# EAGLE design auxboxshield1.7test (EAGLE 6.5.0)
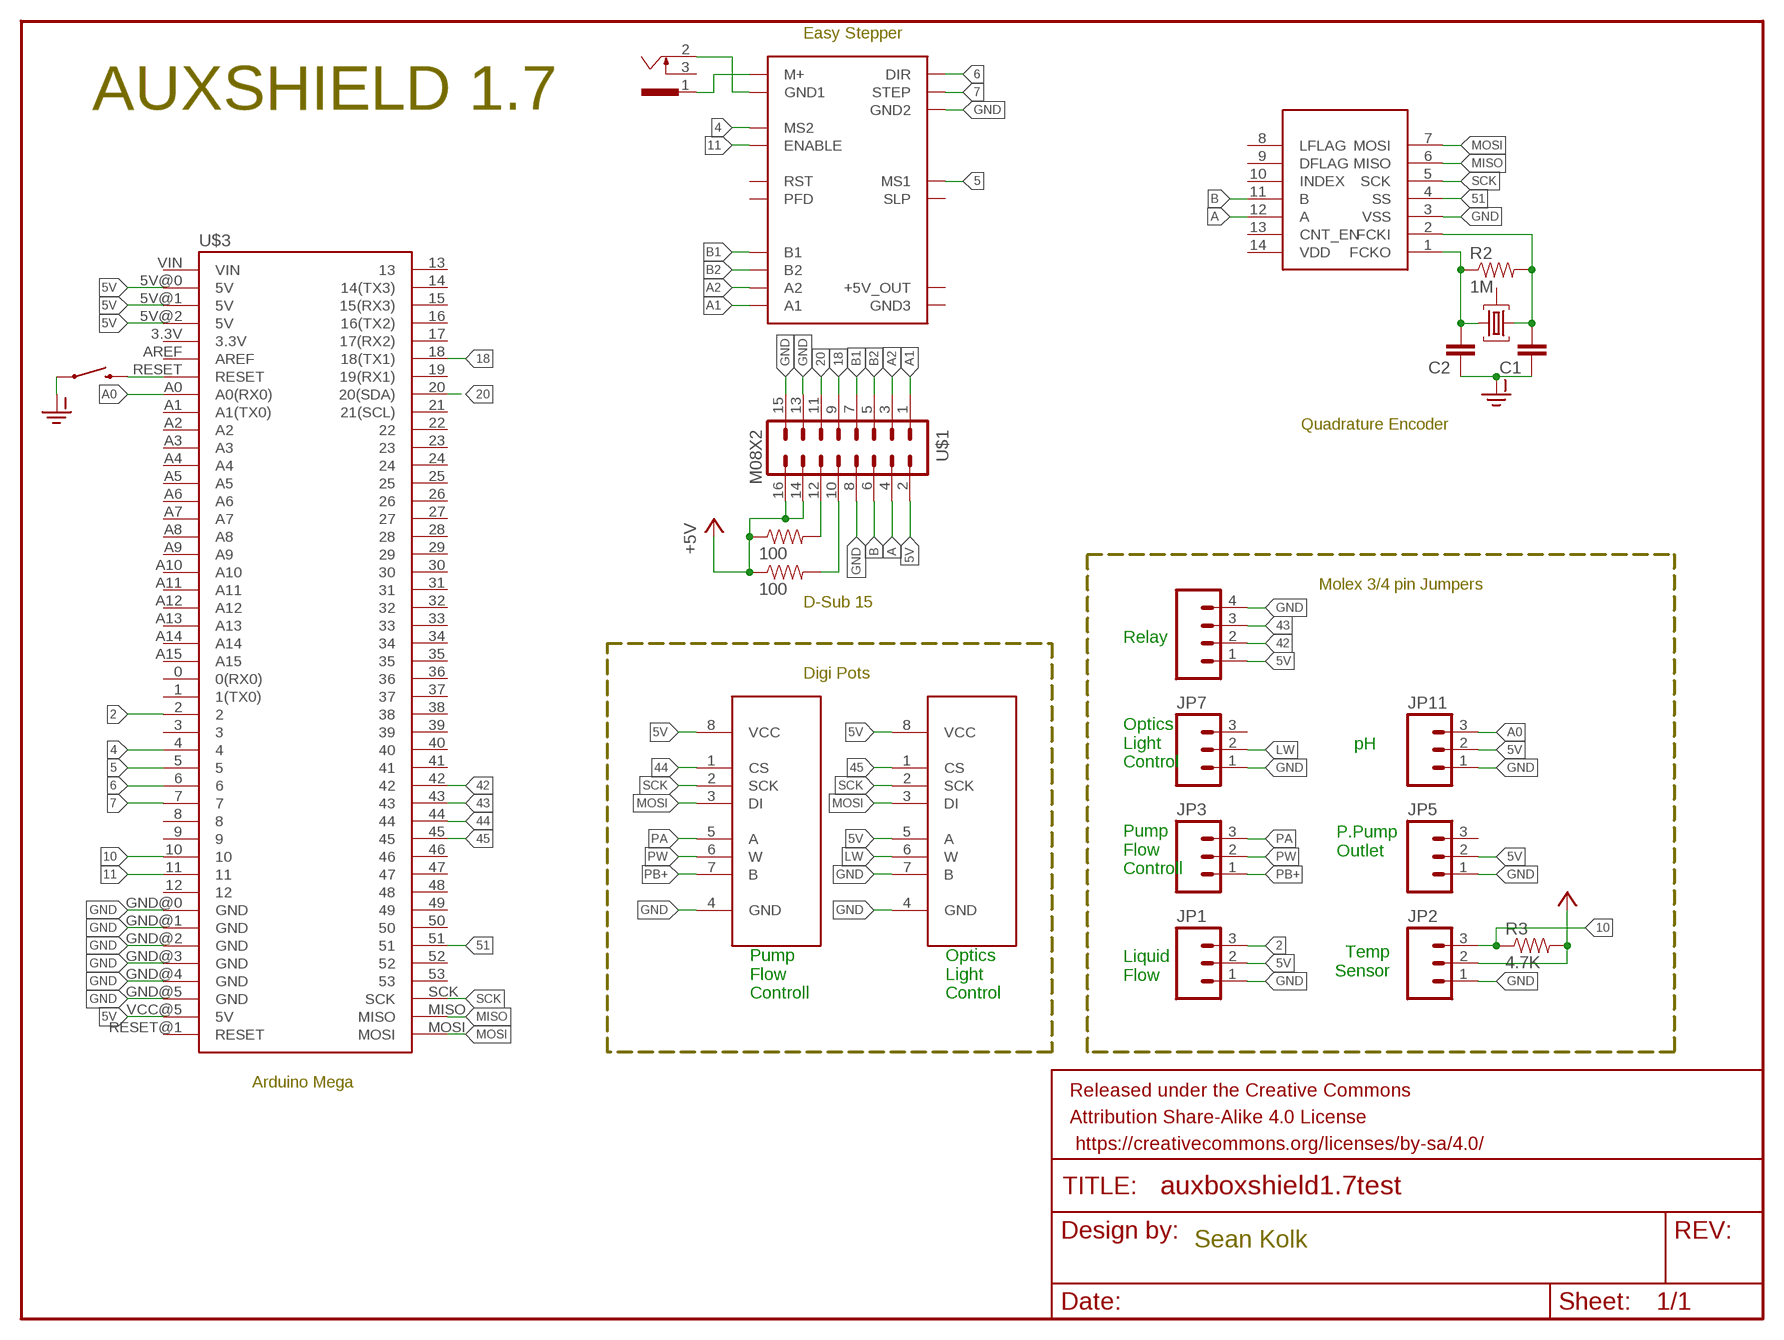
[diagram p0: schematic, sheet 1]

## Parts
C1  0.1UF-50V-20%(PTH)KIT-EZ  [CAP-PTH-SMALL-KIT]
C2  0.1UF-50V-20%(PTH)KIT-EZ  [CAP-PTH-SMALL-KIT]
EASYDRIVER_V44  EASYDRIVER_V44  [EASYDRIVER_V44]
FRAME1  FRAME-LETTER  [CREATIVE_COMMONS]
JP1  M03POLAR  [MOLEX-1X3]
JP2  M03POLAR  [MOLEX-1X3]
JP3  M03POLAR  [MOLEX-1X3]
JP5  M03POLAR  [MOLEX-1X3]
JP7  M03POLAR  [MOLEX-1X3]
JP11  M03POLAR  [MOLEX-1X3]
PUMPDIGIPOT  MCP41XXXDIL  [DIL-08]
QF1  21M30AUM5  [UM5]
R1  100  10OHM-1/4W-5%(PTH)  [AXIAL-0.3]
R2  1M  10OHM-1/4W-5%(PTH)  [AXIAL-0.3]
R3  4.7K  10OHM-1/4W-5%(PTH)  [AXIAL-0.3]
R4  100  10OHM-1/4W-5%(PTH)  [AXIAL-0.3]
RELAY  M04POLAR  [MOLEX-1X4]
S1  SWITCH-MOMENTARY-2PTH_EZ  [TACTILE-PTH-EZ]
U1  MCP41XXXDIL  [DIL-08]
U$1  M08X2  [2X8]
U$2  LS7366R  [SO014]
U$3  ARDUINO-MEGA-V2  [ARDUINO_MEGA-PRO-5V]
X1  SCD-014A  [SCD-014-A]

## Nets
2: JP1.3 U$3.2
4: EASYDRIVER_V44.MS2 U$3.4
5: EASYDRIVER_V44.MS1 U$3.5
5V: JP1.2 JP5.2 JP11.2 PUMPDIGIPOT.8(VCC) RELAY.1 U1.5(A) U1.8(VCC) U$1.2 U$3.5V@0(5V) U$3.5V@1(5V) U$3.5V@2(5V) U$3.VCC@5(5V)
6: EASYDRIVER_V44.DIR U$3.6
7: EASYDRIVER_V44.STEP U$3.7
10: JP2.3 R3.P$1 U$3.10
11: EASYDRIVER_V44.ENABLE U$3.11
18: U$1.9 U$3.18(18(TX1))
20: U$1.11 U$3.20(20(SDA))
42: RELAY.2 U$3.42
43: RELAY.3 U$3.43
44: PUMPDIGIPOT.1(CS) U$3.44
45: U1.1(CS) U$3.45
51: U$2.4(SS) U$3.51
+5V: JP2.2 R1.P$1 R3.P$2 R4.P$1 U$1.14 U$1.16
A: U$1.4 U$2.12(A)
A0: JP11.3 U$3.A0(A0(RX0))
A1: EASYDRIVER_V44.A1 U$1.1
A2: EASYDRIVER_V44.A2 U$1.3
B: U$1.6 U$2.11(B)
B1: EASYDRIVER_V44.B1 U$1.7
B2: EASYDRIVER_V44.B2 U$1.5
GND: EASYDRIVER_V44.GND2 JP1.1 JP2.1 JP5.1 JP7.1 JP11.1 PUMPDIGIPOT.4(GND) RELAY.4 U1.4(GND) U1.7(B) U$1.8 U$1.13 U$1.15 U$2.3(VSS) U$3.GND@0(GND) U$3.GND@1(GND) U$3.GND@2(GND) U$3.GND@3(GND) U$3.GND@4(GND) U$3.GND@5(GND)
GND-ISO: C1.1 C2.1 S1.1
LW: JP7.2 U1.6(W)
MISO: U$2.6(MISO) U$3.MISO
MOSI: PUMPDIGIPOT.3(DI) U1.3(DI) U$2.7(MOSI) U$3.MOSI
N$1: EASYDRIVER_V44.M+ X1.1
N$4: R1.P$2 U$1.10
N$6: EASYDRIVER_V44.GND1 X1.2
N$9: S1.3 U$3.RESET
N$12: C1.2 QF1.1 R2.P$2 U$2.2(FCKI)
N$25: C2.2 QF1.3 R2.P$1 U$2.1(FCKO)
N$33: R4.P$2 U$1.12
PA: JP3.3 PUMPDIGIPOT.5(A)
PB+: JP3.1 PUMPDIGIPOT.7(B)
PW: JP3.2 PUMPDIGIPOT.6(W)
SCK: PUMPDIGIPOT.2(SCK) U1.2(SCK) U$2.5(SCK) U$3.SCK
Unconnected: EASYDRIVER_V44.GND3 EASYDRIVER_V44.P$11(+5V_OUT) EASYDRIVER_V44.PFD EASYDRIVER_V44.RST EASYDRIVER_V44.SLEEP(SLP) JP5.3 JP7.3 QF1.2 U$2.8(LFLAG) U$2.9(DFLAG) U$2.10(INDEX) U$2.13(CNT_EN) U$2.14(VDD) U$3.0(0(RX0)) U$3.1(1(TX0)) U$3.3 U$3.3.3V U$3.8 U$3.9 U$3.12 U$3.13 U$3.14(14(TX3)) U$3.15(15(RX3)) U$3.16(16(TX2)) U$3.17(17(RX2)) U$3.19(19(RX1)) U$3.21(21(SCL)) U$3.22 U$3.23 U$3.24 U$3.25 U$3.26 U$3.27 U$3.28 U$3.29 U$3.30 U$3.31 U$3.32 U$3.33 U$3.34 U$3.35 U$3.36 U$3.37 U$3.38 U$3.39 U$3.40 U$3.41 U$3.46 U$3.47 U$3.48 U$3.49 U$3.50 U$3.52 U$3.53 U$3.A1(A1(TX0)) U$3.A2 U$3.A3 U$3.A4 U$3.A5 U$3.A6 U$3.A7 U$3.A8 U$3.A9 U$3.A10 U$3.A11 U$3.A12 U$3.A13 U$3.A14 U$3.A15 U$3.AREF U$3.RESET@1(RESET) U$3.VIN X1.3

## Notes on the sheet
- Easy Stepper
- AUXSHIELD 1.7
- Quadrature Encoder
- Molex 3/4 pin Jumpers
- D-Sub 15
- Relay
- Digi Pots
- pH
- Optics
  Light 
  Control
- P.Pump 
  Outlet
- Pump
  Flow
  Controll
- Temp
  Sensor
- Liquid 
  Flow
- Pump
  Flow
  Controll
- Optics
  Light
  Control
- Arduino Mega
- Sean Kolk

## Library data of the parts
C1 C2 = SparkFun-Capacitors:0.1UF-50V-20%(PTH): CAP-08370; PROD_ID: CAP-08370
EASYDRIVER_V44 = EasyDriver:EASYDRIVER_V44: EasyDriver version 4.4 - http://www.schmalzhaus.com/EasyDriver
FRAME1 = SparkFun-Aesthetics:FRAME-LETTER: Schematic Frame Standard 8.5x11 US Letter frame
JP1-JP3 JP5 JP7 JP11 = SparkFun-Connectors:M03: Header 3 Standard 3-pin 0.1" header. Use with straight break away headers (SKU : PRT-00116), right angle break away headers (PRT-00553), swiss pins (PRT-00743), machine pins (PRT-00117), and female headers (PRT-00115). Molex polarized connector foot print use with SKU : PRT-08232 with associated crimp pins and housings.
PUMPDIGIPOT U1 = SparkFun-AnalogIC:MCP41XXX: SPI controlled single digital potentiometer by Microchip PID: COM-10613
QF1 = crystal:21M*A: Monolithic Crystal Filters Source: www.vanlong.com; OC_FARNELL: unknown; OC_NEWARK: unknown
R1-R4 = SparkFun-Resistors:10OHM-1/4W-5%(PTH): RES-10698; PROD_ID: RES-10698; VALUE: 10
RELAY = SparkFun-Connectors:M04: Header 4 Standard 4-pin 0.1" header. Use with straight break away headers (SKU : PRT-00116), right angle break away headers (PRT-00553), swiss pins (PRT-00743), machine pins (PRT-00117), and female headers (PRT-00115). Molex polarized connector foot print use with SKU : PRT-08231 with associated crimp pins and housings. 1MM SMD Version SKU: PRT-10208
S1 = SparkFun-Electromechanical:SWITCH-MOMENTARY-2: Various NO switches- pushbuttons, reed, etc
U$1 = SparkFun-Connectors:M08X2: .1" headers, two rows of 8 each
U$2 = SparkFun-DigitalIC:LS7366R
U$3 = MEGASHIELD2:ARDUINO-MEGA-V2
X1 = con-shiua-chyuan:SCD-014A: Power Jack 2.5mm; OC_FARNELL: unknown; OC_NEWARK: unknown

## Board
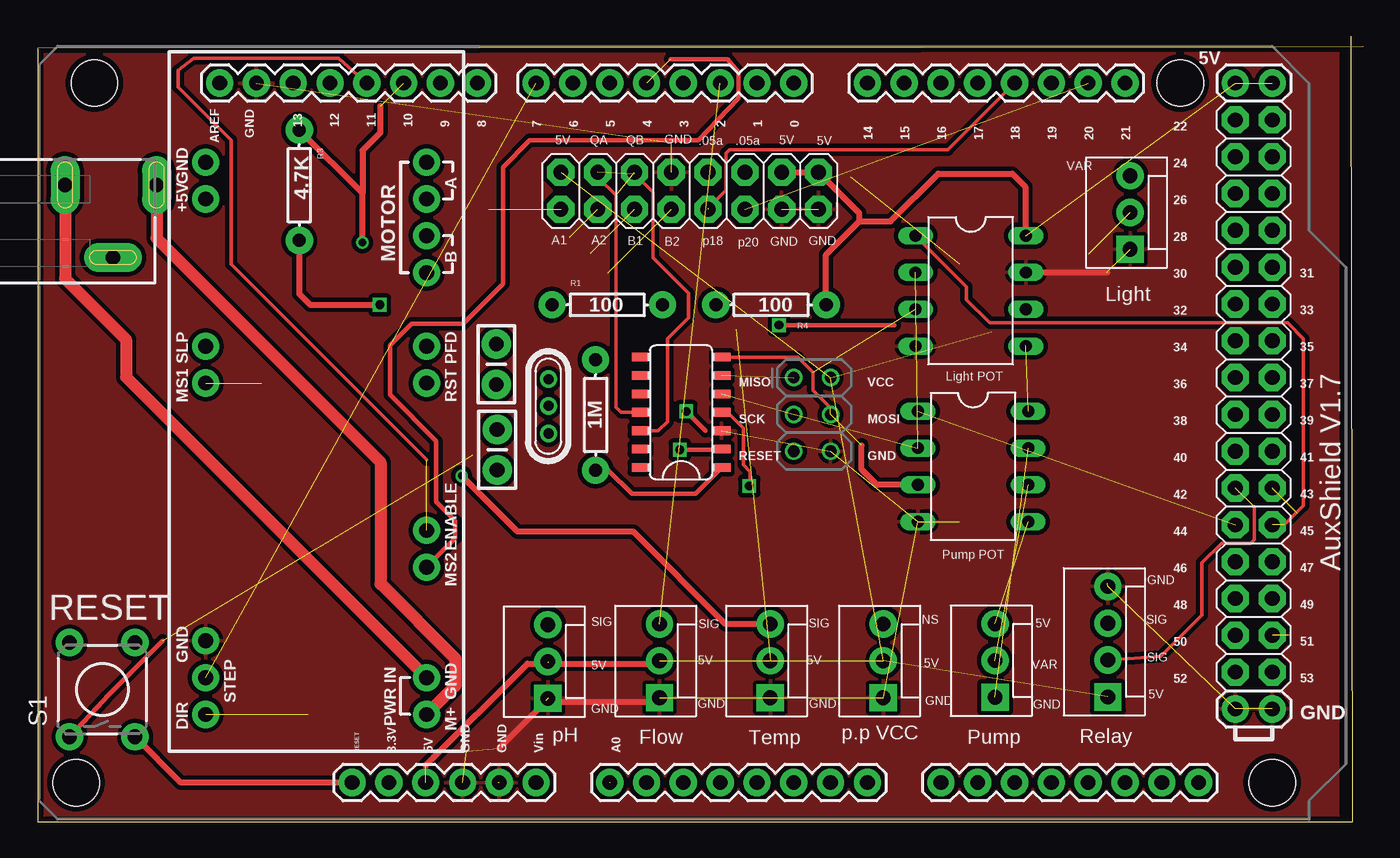
[diagram p1: board, top side]
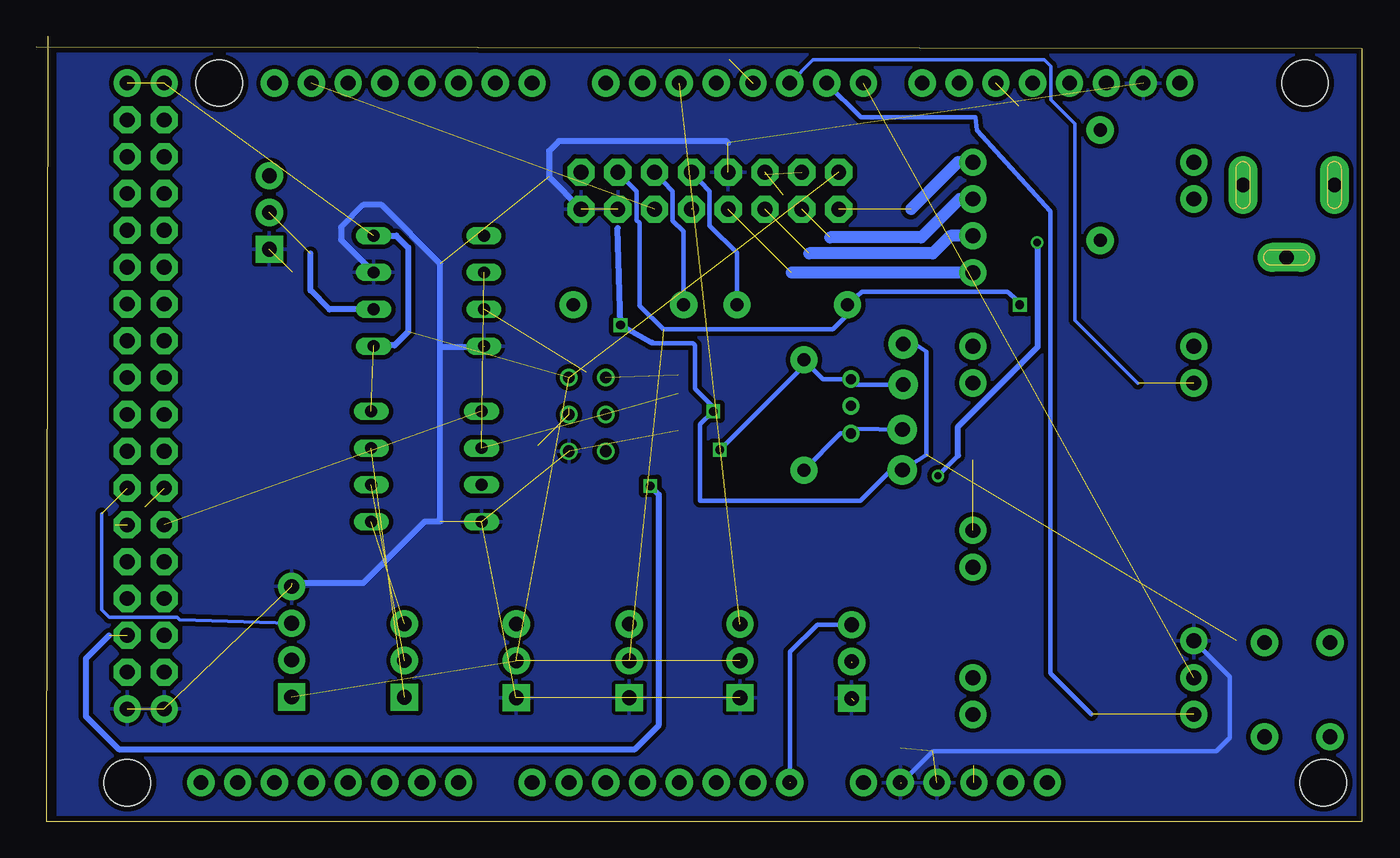
[diagram p2: board, bottom side, seen from below]

Size 91.48 x 54.18 mm. Coordinates in mm from the lower left corner, seen from the top.
Outline: 90.65,54.18 90.75,0 0,0 0,53.33
Outline: 91.48,53.44 0,53.34
Copper layers (1*16): Top 0.0356mm / dielectric 1.5011mm / Bottom 0.0356mm
Design rules "LaenPCBOrder (1)": minimum track width 6mil, minimum drill 13mil, track to track 6mil, track to pad 6mil, pad to pad 6mil, via to via 6mil, smd to smd 6mil, copper to edge 15mil, drill to drill 6mil, minimum pad ring 7mil, minimum via ring 7mil, stop-mask expansion 3mil, vias tented up to drill 0mil, thermal gap 10mil

### Footprints (pad centres in the part's own frame; a part is rotated, then mirrored left to right if it is on the bottom)
CAP-PTH-SMALL-KIT = drill 1.016 pad 2.032: 1 -1.397,0; 2 1.397,0
EASYDRIVER_V44 = drill 1.016 pad 1.88: A1 -16.51,7.62; A2 -13.97,7.62; B1 -8.89,7.62; B2 -11.43,7.62; DIR 21.59,-7.62; ENABLE 8.89,7.62; GND1 19.05,7.62; GND2 16.51,-7.62; GND3 -16.51,-7.62; M+ 21.59,7.62; MS1 -1.27,-7.62; MS2 11.43,7.62; P$11 -13.97,-7.62; PFD -3.81,7.62; RST -1.27,7.62; SLEEP -3.81,-7.62; STEP 19.05,-7.62
MOLEX-1X3 = drill 1.016 pad 1.88 square: 1 0,0 | drill 1.016 pad 1.88: 2 2.54,0; 3 5.08,0
DIL-08 = drill 0.813 long: 1 -3.81,-3.81; 2 -1.27,-3.81; 3 1.27,-3.81; 4 3.81,-3.81; 5 3.81,3.81; 6 1.27,3.81; 7 -1.27,3.81; 8 -3.81,3.81
UM5 = drill 0.7 pad 1.2: 1 -1.875,0; 2 -0.027,0; 3 1.875,0
AXIAL-0.3 = drill 0.9 pad 1.88: P$1 -3.81,0; P$2 3.81,0
MOLEX-1X4 = drill 1.016 pad 1.88 square: 1 0,0 | drill 1.016 pad 1.88: 2 2.54,0; 3 5.08,0; 4 7.62,0
TACTILE-PTH-EZ = drill 1.016 pad 1.88: 1 -3.251,2.261; 2 3.251,2.261; 3 -3.251,-2.261; 4 3.251,-2.261
2X8 = drill 1.016 pad 1.88 octagon: 1 0,0; 2 0,2.54; 3 2.54,0; 4 2.54,2.54; 5 5.08,0; 6 5.08,2.54; 7 7.62,0; 8 7.62,2.54; 9 10.16,0; 10 10.16,2.54; 11 12.7,0; 12 12.7,2.54; 13 15.24,0; 14 15.24,2.54; 15 17.78,0; 16 17.78,2.54
SO014 = smd 0.6 x 1.2: 1 -3.175,-2.8; 2 -1.905,-2.8; 3 -0.635,-2.8; 4 0.635,-2.8; 5 1.905,-2.8; 6 3.175,-2.8; 7 4.445,-2.8; 8 4.445,2.8; 9 3.175,2.8; 10 1.905,2.8; 11 0.635,2.8; 12 -0.635,2.8; 13 -1.905,2.8; 14 -3.175,2.8
ARDUINO_MEGA-PRO-5V = drill 1.016 pad 1.88: 0 52.07,50.8; 1 49.53,50.8; 2 46.99,50.8; 3 44.45,50.8; 3.3V 24.13,2.54; 4 41.91,50.8; 5 39.37,50.8; 5V@0 26.67,2.54; 5V@1 82.55,50.8; 5V@2 85.09,50.8; 6 36.83,50.8; 7 34.29,50.8; 8 30.226,50.8; 9 27.686,50.8; 10 25.146,50.8; 11 22.606,50.8; 12 20.066,50.8; 13 17.526,50.8; 14 57.15,50.8; 15 59.69,50.8; 16 62.23,50.8; 17 64.77,50.8; 18 67.31,50.8; 19 69.85,50.8; 20 72.39,50.8; 21 74.93,50.8; A0 39.37,2.54; A1 41.91,2.54; A2 44.45,2.54; A3 46.99,2.54; A4 49.53,2.54; A5 52.07,2.54; A6 54.61,2.54; A7 57.15,2.54; A8 62.23,2.54; A9 64.77,2.54; A10 67.31,2.54; A11 69.85,2.54; A12 72.39,2.54; A13 74.93,2.54; A14 77.47,2.54; A15 80.01,2.54; AREF 12.446,50.8; GND@0 29.21,2.54; GND@1 31.75,2.54; GND@2 82.55,7.62; GND@3 85.09,7.62; GND@4 14.986,50.8; RESET 21.59,2.54; VIN 34.29,2.54 | drill 1.016 pad 1.88 octagon: 22 82.55,48.26; 23 85.09,48.26; 24 82.55,45.72; 25 85.09,45.72; 26 82.55,43.18; 27 85.09,43.18; 28 82.55,40.64; 29 85.09,40.64; 30 82.55,38.1; 31 85.09,38.1; 32 82.55,35.56; 33 85.09,35.56; 34 82.55,33.02; 35 85.09,33.02; 36 82.55,30.48; 37 85.09,30.48; 38 82.55,27.94; 39 85.09,27.94; 40 82.55,25.4; 41 85.09,25.4; 42 82.55,22.86; 43 85.09,22.86; 44 82.55,20.32; 45 85.09,20.32; 46 82.55,17.78; 47 85.09,17.78; 48 82.55,15.24; 49 85.09,15.24; 50 82.55,12.7; 51 85.09,12.7; 52 82.55,10.16; 53 85.09,10.16 | drill 0.8: GND@5 54.61,25.4; MISO 52.07,30.48; MOSI 54.61,27.94; RESET@1 52.07,25.4; SCK 52.07,27.94; VCC@5 54.61,30.48 | hole 3.2: 3.81,50.8; 2.54,2.54; 78.74,50.8; 85.09,2.54
SCD-014-A = drill 1 pad 2 long: 1 -2.5,13.8; 2 -2.5,7.5; 3 2.5,10.8

### Placement (x,y rotation side)
C1  31.65,31.55 270 top
C2  31.7,25.65 90 top
EASYDRIVER_V44  19.21,28.98 270 top
FRAME1  5.1,-14.95 0 top  (outside the outline)
JP1  42.9,8.55 90 top
JP2  50.55,8.55 90 top
JP3  66.06,8.57 90 top
JP5  58.35,8.55 90 top
JP7  75.39,39.48 90 top
JP11  35.2,8.5 90 top
PUMPDIGIPOT  64.55,24.5 270 top
QF1  35.25,28.65 270 top
R1  39.3,35.65 0 top
R2  38.5,28.05 90 top
R3  18.05,43.9 270 top
R4  50.6,35.65 180 top
RELAY  73.85,8.6 90 top
S1  4.45,9.1 90 top
U1  64.39,36.62 270 top
U$1  36.1,42.25 0 top
U$2  44.4,27.6 90 top
U$3  0.1,0.15 0 top
X1  -5.61,41.42 270 top

### Tracks (layer width: path | path; a pad name or v marks a point on that pad's centre or on a via)
2  (1 unrouted)
4  (1 unrouted)
  Top 0.305: EASYDRIVER_V44.MS2 26.83,17.58 28.8,19.55 28.8,20.75 27.5,22.05 27.5,26.25 24.3,29.45 24.3,32.85 25.8,34.35 29.35,34.35 32.1,37.1 32.1,45.15 33.95,47 45.6,47 48.35,49.9 48.35,51.7 47.6,52.6 43.66,52.6
5  (1 unrouted)
  Bottom 0.254: 15.45,30.25 19.8,34.6 19.8,48.15 21.45,49.8 21.45,52.1 21.9,52.55 37.87,52.55 U$3.5
5V  (11 unrouted)
  Top 0.305: 35.2,10.95 35.25,10.9
  Top 0.406: 26.77,3.87 33.8,10.9 35.25,10.9 42.71,10.9 JP1.2
  Bottom 0.406: U1.8 66.62,40.42 65.8,39.6 65.8,33.8 66.75,32.85 68.15,32.85
6  (1 unrouted)
  Bottom 0.305: 18.64,7.39 21.5,10.25 21.5,42.1 26.55,47.7 26.65,48.58 34.56,48.58 U$3.6
7  (1 unrouted)
10  (via drill 0.5 pad 0.25)  (1 unrouted)
  Top 0.406: JP2.3 47.47,13.63 41.1,20 33.1,20 v29.25,23.85 | 23.65,49.35 23.65,47.55 22.4,46.3 22.4,43.36 | v22.4,39.95 22.4,43.36 | 22.4,43.36 R3.P$1
  Bottom 0.305: 27.85,25.25 v29.25,23.85
  Bottom 0.406: 27.85,25.25 27.85,27.25 22.35,32.75 22.35,39.9 v22.4,39.95
11  (1 unrouted)
  Top 0.254: 26.83,24.97 13.35,38.45 13.35,47 9.7,50.65 9.7,51.85 10.75,52.65 20.76,52.65 U$3.11
18  (1 unrouted)
  Top 0.254: 46.26,42.31 47.5,43.55 47.5,46.1 47.75,46.35 62.81,46.35 U$3.18
20  (1 unrouted)
42  (1 unrouted)
  Top 0.254: RELAY.2 77.49,11.39 80.35,14.25 80.35,17.85 81.7,19.2 83.7,19.2 83.95,19.45 83.95,21.71
43  (1 unrouted)
  Bottom 0.254: RELAY.3 81.58,13.93 81.75,14.1 86.45,14.1 86.95,14.6 86.95,21.25
44  (1 unrouted)
45  (1 unrouted)
  Top 0.254: 86.02,20.47 87.35,21.8 87.35,33.3 86.25,34.4 65.7,34.4 64.1,36 64.1,36.9 U1.1
51  (via drill 0.6)  (1 unrouted)
  Top 0.254: U$2.4 47.62,28.23 48.7,27.15 48.7,24.6 49.15,24.15 49.15,23.2 v49.1,23.15
  Bottom 0.406: 86.45,12.85 88.05,11.25 88.05,7.25 85.8,5 50.15,5 48.5,6.65 48.5,22.55 v49.1,23.15
+5V  (via drill 0.6)  (1 unrouted)
  Top 0.406: R4.P$1 54.41,39.11 56.7,41.4 | 56.7,41.4 56.7,41.97 U$1.16 U$1.14 | 56.7,41.4 58.85,41.4 62.15,44.7 67.25,44.7 68.15,43.8 68.15,40.47 | R3.P$2 18.05,36.4 18.8,35.65 v23.6,35.65
  Bottom 0.305: v23.6,35.65 23.75,35.5 23.75,35.95 24.45,36.55 34.49,36.55 R1.P$1 35.49,34.96 36.5,33.95 48.2,33.95 49.85,35.6 49.85,41.3 50.05,41.5 50.05,43.5 U$1.14
  Bottom 0.406: 35.34,35.5 R1.P$1
A  (1 unrouted)
  Top 0.254: 41.18,44.67 42.45,43.4 42.45,38.9 44.9,36.45 44.9,34.75 43.45,33.3 43.45,27.6 42.8,26.95 41.62,26.95 U$2.12
A0  (1 unrouted)
  Bottom 0.305: JP11.3 37.57,13.58 39.45,11.7 39.45,2.71
A1  (1 unrouted)
  Bottom 0.813: EASYDRIVER_V44.A1 27.86,45.49 31.1,42.25
A2  (1 unrouted)
  Bottom 0.813: EASYDRIVER_V44.A2 27.75,42.95 30.4,40.3 36.69,40.3
B  (1 unrouted)
  Top 0.254: 38.64,44.46 39.9,43.2 39.9,28.6 40.25,28.25 41.59,28.25 U$2.11
B1  (1 unrouted)
  Bottom 0.813: EASYDRIVER_V44.B1 39.34,37.87
B2  (1 unrouted)
  Bottom 0.813: EASYDRIVER_V44.B2 28.39,40.41 29.6,39.2 38.13,39.2
GND  (19 unrouted)
  Top 0.305: 35.05,8.25 35.05,8.35 | 11.62,12.5 EASYDRIVER_V44.GND2
  Top 0.406: JP1.1 42.6,8.25 35.05,8.25 31.85,5.05 | U1.7 73.8,37.88
  Bottom 0.305: 31.76,2.69 29.6,4.85 10.05,4.85 9.1,5.8 9.1,9.98 EASYDRIVER_V44.GND2
  Bottom 0.406: 63.6,32.75 63.6,20.69 64.66,20.69 68.9,16.45 73.83,16.45 | 63.6,32.75 60.58,32.75 | 63.6,32.75 63.6,38.5 67.65,42.55 68.9,42.55 70.45,41 70.45,40.14 U1.7 | 43.72,46.82 43.85,46.95 55.4,46.95 56.1,46.25 56.1,44.47 U$1.15
  pour Bottom (isolate 0.305, rank 2): 0.3,0.3 89.95,0.3 89.95,53.65 0.3,53.65
  pour Top (isolate 0.305, rank 2): 0.2,0.25 89.7,0.25 89.7,53.65 0.2,53.65
GND-ISO  (via drill 0.6)  (1 unrouted)
  Top 0.305: 8.62,12.47 4.8,8.65 4.55,8.36 S1.1 | 46.09,26.96 v44.75,28.3 | v51.15,34.25 59.13,34.25
  Bottom 0.305: C1.1 30.8,32.95 30.05,32.4 30.05,25.3 C2.1 32.5,24.25 34.6,22.15 45.65,22.15 45.65,27.4 v44.75,28.3 44.75,28.6 46,29.85 46,32.85 46.15,33 48.95,33 49,33.05
  Bottom 0.406: 49,33.05 v51.15,34.25 51.35,40.96
LW  (1 unrouted)
  Bottom 0.406: U1.6 71.25,35.34 72.55,36.65 72.55,39.18
MISO  (1 unrouted)
MOSI  (3 unrouted)
  Top 0.254: 54.71,28.54 53.5,29.75 53.5,31 52.45,32.05 U$2.7
  Top 0.406: PUMPDIGIPOT.3 57.92,23.23 56.85,24.3 56.85,25.95
N$1
  Top 0.813: X1.1 8.19,40.26 23.65,24.8 23.65,16.4 28.8,11.25 28.8,9.36 EASYDRIVER_V44.M+
N$4
  Bottom 0.305: R1.P$2 43.11,39.26 45,41.1 45,43.48 U$1.10
N$6
  Top 0.813: X1.2 1.89,37.46 6.1,33.25 6.1,30.66 EASYDRIVER_V44.GND1
N$9
  Top 0.406: U$3.RESET 9.87,2.69 S1.3
N$12  (via drill 0.6)
  Top 0.305: v44.3,25.65 47.16,25.65 U$2.2
  Bottom 0.305: C1.2 34.88,30.15 QF1.1 37.16,30.52 R2.P$2 38.5,31.45 v44.3,25.65
N$25
  Top 0.305: R2.P$1 39.36,24.24 41,22.6 45.38,22.6 U$2.1
  Bottom 0.305: C2.2 34.93,27.1 QF1.3 35.97,26.77 R2.P$1
N$33
  Bottom 0.305: R4.P$2 46.79,40.74 47.55,41.45 47.55,43.49 U$1.12
PA  (1 unrouted)
PB+  (1 unrouted)
PW  (1 unrouted)
SCK  (3 unrouted)

### Text on the board
tPlace: 5V | QA | QB | GND | .05a | .05a | 5V | 5V | VAR | A1 | A2 | B1 | B2 | p18 | p20 | GND | GND | Light | Light POT | Pump POT | AuxShield V1.7 | GND | RESET | NS | SIG | SIG | SIG | SIG | 5V | 5V | 5V | 5V | VAR | SIG | 5V | GND | GND | GND | GND | 5V | GND | pH | p.p VCC | Flow | Temp | Pump | Relay
DrillLegend_01-16: 01-16